# Altium project Environmental_unit.PrjPcb (part 1 of 2)
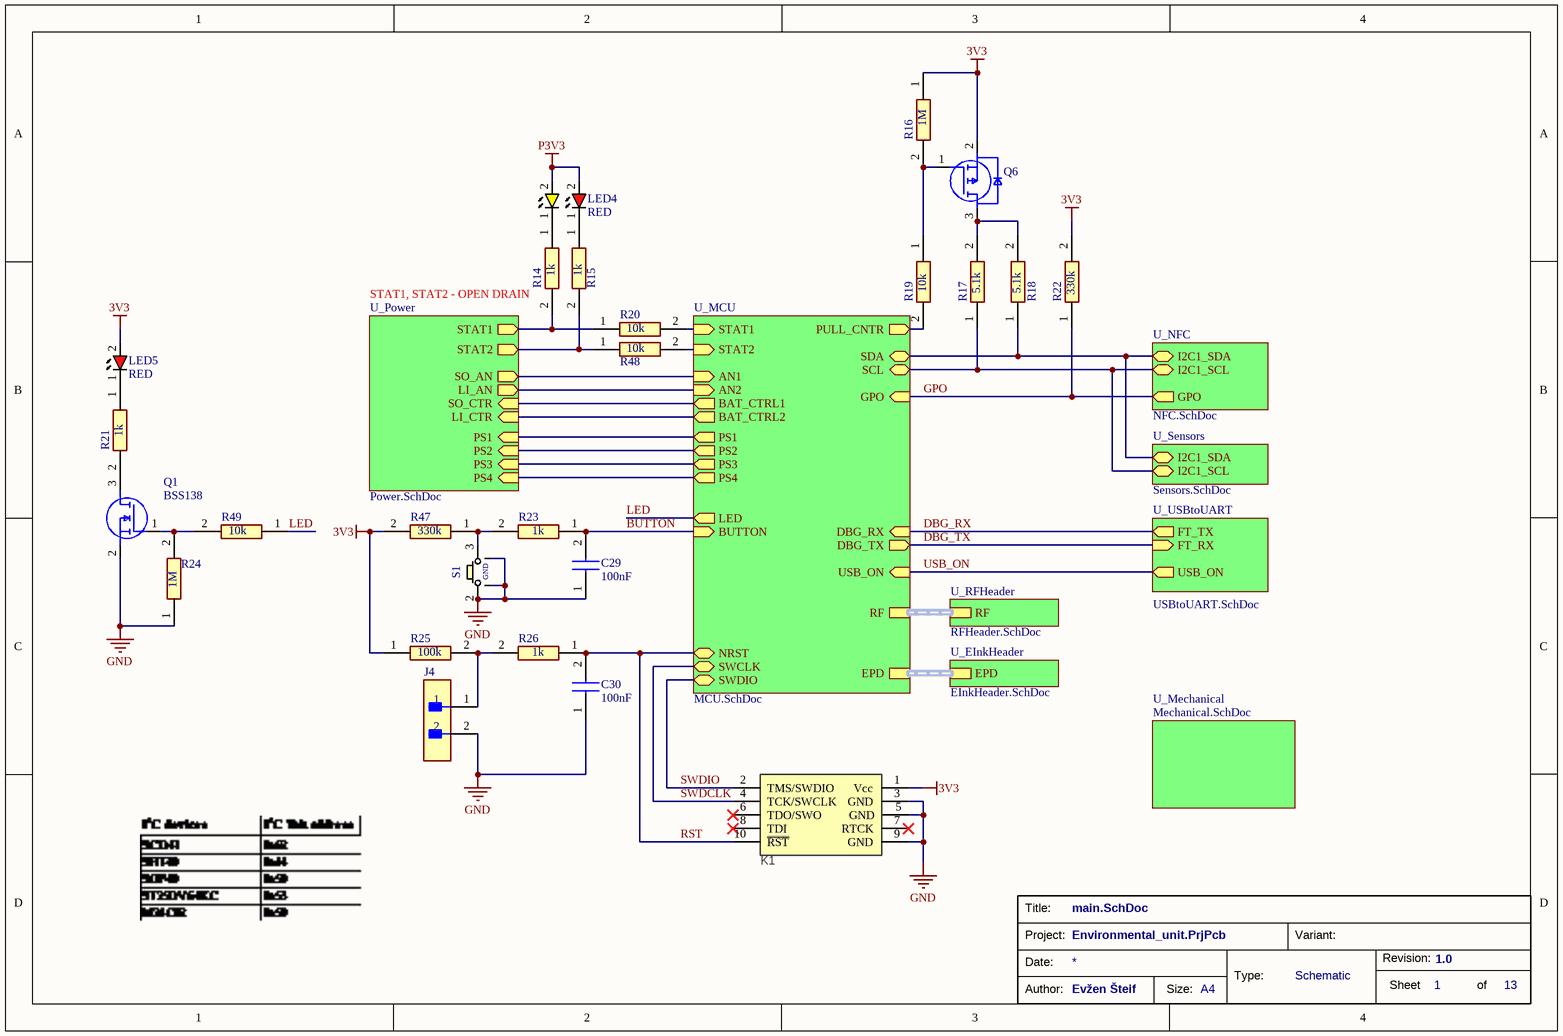
[diagram p0: main.SchDoc]
Author: Evžen Šteif; Revision: 1.0
9 sheets, 135 parts. Net scope: hierarchical (ports join the sheet entries above them; power ports are global).
Board file: EnvUnitPCB.PcbDoc
Sheets:
  main.SchDoc
    U_USBtoUART = USBtoUART.SchDoc
    U_NFC = NFC.SchDoc
    U_EInkHeader = EInkHeader.SchDoc
    U_MCU = MCU.SchDoc
    U_RFHeader = RFHeader.SchDoc
    U_Power = Power.SchDoc
      U_BatteryManagement = BatteryManagement.SchDoc
    U_Mechanical = Mechanical.SchDoc

## Sheet main.SchDoc
size A4; SheetNumber: 1; SheetTotal: 13

### Parts
C29  100nF  [CAPC1005X70N]
C30  100nF  [CAPC1005X70N]
J4  M20-9990246  [FP-M20-9990246-MFG]  (value not drawn)
K1  3220-10-0100-00  [TH_CON_MHDR2X5_PIT50_KEY]  (value not drawn)
LED3  150060YS75000  [LEDC1608X80N]  (value not drawn)
LED4  RED  [LEDC1608X80N]
LED5  RED  [LEDC1608X80N]
Q1  BSS138  [SOT95P240X120-3N]
Q6  SSM3J358R,LF  [SOTFL95P240X88-3N]  (value not drawn)
R14  1k  [RESC1005X35N]
R15  1k  [RESC1005X35N]
R16  1M  [RESC1005X40N]
R17  5.1k  [RESC1005X35N]
R18  5.1k  [RESC1005X35N]
R19  10k  [RESC1005X35N]
R20  10k  [RESC1005X35N]
R21  1k  [RESC1005X35N]
R22  330k  [RESC1005X40N]
R23  1k  [RESC1005X35N]
R24  1M  [RESC1005X40N]
R25  100k  [RESC1005X35N]
R26  1k  [RESC1005X35N]
R47  330k  [RESC1005X40N]
R48  10k  [RESC1005X35N]
R49  10k  [RESC1005X35N]
S1  431256038716  [431256038716]  (value not drawn)

### Sub-sheets
U_EInkHeader = EInkHeader.SchDoc: EPD (harness E1)
U_MCU = MCU.SchDoc: SWDIO (bidir), SWCLK (bidir), NRST (bidir), RF (harness RF_HARNESS), EPD (harness EPD_HARNESS), SCL (bidir), SDA (bidir), AN1 (in), AN2 (in), DBG_TX (out), DBG_RX (in), USB_ON (in), PS1 (out), PS2 (out), PS3 (out), PS4 (out), GPO (in), BUTTON (in), LED (out), STAT1 (in), STAT2 (in), BAT_CTRL1 (out), BAT_CTRL2 (out), PULL_CNTR (out)
U_Mechanical = Mechanical.SchDoc: no entries
U_NFC = NFC.SchDoc: GPO (out), I2C1_SCL (bidir), I2C1_SDA (bidir)
U_Power = Power.SchDoc: PS1 (in), PS2 (in), PS3 (in), LI_AN (out), SO_AN (out), LI_CTR (in), SO_CTR (in), PS4 (in), STAT1 (out), STAT2 (out)
U_RFHeader = RFHeader.SchDoc: RF (harness RF_HARNESS1)
U_Sensors = Sensors.SchDoc (file not in this document): I2C1_SDA (bidir), I2C1_SCL (bidir)
U_USBtoUART = USBtoUART.SchDoc: FT_TX (out), FT_RX (in), USB_ON (out)

### Nets
3V3: K1.1(Vcc) LED5.2(A) Q6.2(S) R16.1 R22.2 R25.1 R47.2
GND: C29.1 C30.1 J4.2 K1.3(GND) K1.5(GND) K1.9(GND) Q1.2(S) R24.1 S1.1 S1.2 S1.4
P3V3: LED3.2(A) LED4.2(A)
BUTTON: C29.2 R23.1 ; sheet U_MCU/BUTTON
DBG_RX: sheet U_USBtoUART/FT_TX, sheet U_MCU/DBG_RX
DBG_TX: sheet U_USBtoUART/FT_RX, sheet U_MCU/DBG_TX
GPO: R22.1 ; sheet U_NFC/GPO, sheet U_MCU/GPO
LED: R49.1 ; sheet U_MCU/LED
PS1: sheet U_MCU/PS1, sheet U_Power/PS1
PS2: sheet U_MCU/PS2, sheet U_Power/PS2
PS3: sheet U_MCU/PS3, sheet U_Power/PS3
PS4: sheet U_MCU/PS4, sheet U_Power/PS4
RST: C30.2 K1.10(~{RST}) R26.1 ; sheet U_MCU/NRST
SCL: R17.1 ; sheet U_Sensors/I2C1_SCL, sheet U_NFC/I2C1_SCL, sheet U_MCU/SCL
SDA: R18.1 ; sheet U_Sensors/I2C1_SDA, sheet U_NFC/I2C1_SDA, sheet U_MCU/SDA
STAT1: R14.2 R20.1 ; sheet U_Power/STAT1
STAT2: R15.2 R48.1 ; sheet U_Power/STAT2
SWDCLK: K1.4(TCK/SWCLK) ; sheet U_MCU/SWCLK
SWDIO: K1.2(TMS/SWDIO) ; sheet U_MCU/SWDIO
USB_ON: sheet U_USBtoUART/USB_ON, sheet U_MCU/USB_ON
NetIC3_8: sheet U_MCU/AN1, sheet U_Power/SO_AN
NetIC3_9: sheet U_MCU/AN2, sheet U_Power/LI_AN
NetIC3_10: sheet U_MCU/BAT_CTRL1, sheet U_Power/SO_CTR
NetIC3_11: sheet U_MCU/BAT_CTRL2, sheet U_Power/LI_CTR
NetIC3_17: R20.2 ; sheet U_MCU/STAT1
NetIC3_20: R48.2 ; sheet U_MCU/STAT2
NetIC3_61: R19.2 ; sheet U_MCU/PULL_CNTR
NetJ4_1: J4.1 R25.2 R26.2
NetLED3_1: LED3.1(K) R14.1
NetLED4_1: LED4.1(K) R15.1
NetLED5_1: LED5.1(K) R21.1
NetQ1_1: Q1.1(G) R24.2 R49.2
NetQ1_3: Q1.3(D) R21.2
NetQ6_1: Q6.1(G) R16.2 R19.1
NetQ6_3: Q6.3(D) R17.2 R18.2
NetR23_2: R23.2 R47.1 S1.3

Not connected (* = marked no-connect by the designer): K1 6(TDO/SWO)* 7(RTCK)* 8(TDI)*

### Buses and harness runs
harness sheet U_EInkHeader/EPD = sheet U_MCU/EPD
harness sheet U_MCU/RF = sheet U_RFHeader/RF

### Notes on the sheet
- (near R14) STAT1, STAT2 - OPEN DRAIN
- Title:
- Date:
- Project:
- Type:
- Schematic
- Variant:
- Revision:
- Sheet
- of
- Author:
- Evžen Šteif
- Size:
- A4
- (in symbol 431256038716) GND

### Library data of the parts
C29 C30 = GRM155R61A104KA01D: Capacitor; Manufacturer_Name: Murata Electronics; Datasheet Link: https://search.murata.co.jp/Ceramy/image/img/A01X/G101/ENG/GRM155R61A104KA01-02A.pdf; Height: 0.7mm; Manufacturer_Part_Number: GRM155R61A104KA01D; Mouser Part Number: 81-GRM155R61A104KA01; Mouser Price/Stock: https://www.mouser.co.uk/ProductDetail/Murata-Electronics/GRM155R61A104KA01D?qs=5bAuhL3RhmNZw0v59AqOJA%3D%3D; Arrow Part Number: GRM155R61A104KA01D; Arrow Price/Stock: https://www.arrow.com/en/products/grm155r61a104ka01d/murata-manufacturing?utm_currency=USD&region=europe
J4 = CMP-15831-000009-1: CONN HEADER VERT 2POS 2.54MM; Manufacturer: Harwin; Conn Gender: Male; Conn Orientation: Vertical; Number Of Contacts: 2; Current Rating: 3A; ComponentLink2URL: https://cdn.harwin.com/pdfs/M20-999.pdf; ComponentLink2Description: Datasheet; Package: M20-9990246; Temperature: -40°C to +105°C; Octopart: https://octopart.com/m20-9990246-harwin-2590635; Mouser Description: 2.54mm (0.1") Pitch SIL Vertical PC Tail Pin Header, 6.1mm mating pin height, tin, 2 contacts; Temperature Range High: +105°C; Device Class L1: Connectors; RoHS: TRUE; Automotive: No; Height: 8.99mm; Number Of Rows: 1; Contact Material: Tin,Nickel; Category: Conn; Pitch: 2.54mm; Lead Free: Yes; Digikey Description: CONN HEADER VERT 2POS 2.54MM; Manufacturer Part Number: M20-9990246; Temperature Range Low: -40°C; Device Class L3: unset; Device Class L2: Headers and Wire Housings
K1 = TEST_00015: Cortex ARM JTAG 10 Pin, Header; Manufacturer: CNC Tech; Autor: Krutina; Id: 15; Designer: Krahulec; Active: 1; Validated in design: 0; Count: 585; Generic_replacement: No; LE_Price: 0.363527; Location: LE; Sourcing: Manufacturer; Value: ARM JTAG 10; LastRevisionDate: 28.7.2015; PartNumber: TEST_00015; Technology: THT; Librarian: Krahulec; Supplier 1: Digi-Key; Supplier Part Number 1: 1175-1627-ND; ComponentLink1URL: http://www.cnctech.us/; ComponentLink1Description: Manufacturer Web; Cat1: JTAG; Cat2: ARM; ROHS: 1; Jablotron_Price: 0; Manufacturer Part Number: 3220-10-0100-00
LED3 = 150060YS75000: LED; Manufacturer_Name: Wurth Elektronik; Datasheet Link: http://uk.rs-online.com/web/p/products/8154219; Height: 0.8mm; Manufacturer_Part_Number: 150060YS75000; Mouser Part Number: 710-150060YS75000; Mouser Price/Stock: https://www.mouser.co.uk/ProductDetail/Wurth-Elektronik/150060YS75000?qs=LlUlMxKIyB0nKmwefHgtZw%3D%3D
LED4 LED5 = 150060RS55040: LED; Manufacturer_Name: Wurth Elektronik; Manufacturer_Part_Number: 150060RS75000; Datasheet Link: https://componentsearchengine.com/Datasheets/2/150060GS75000.pdf; Height: 0.8mm; Mouser Part Number: 710-150060RS75000; Mouser Price/Stock: https://www.mouser.co.uk/ProductDetail/Wurth-Elektronik/150060GS75000?qs=LlUlMxKIyB0UYkq5lDO8nA%3D%3D
Q1 = BSS138: MOSFET (N-Channel); Manufacturer_Name: onsemi; Datasheet Link: https://www.onsemi.com/pub/Collateral/BSS138-D.PDF; Height: 1.2mm; Manufacturer_Part_Number: BSS138; Mouser Part Number: 512-BSS138; Mouser Price/Stock: https://www.mouser.co.uk/ProductDetail/onsemi-Fairchild/BSS138?qs=HK%252BeIG1iaahCeqBvjB4arg%3D%3D; Arrow Part Number: BSS138; Arrow Price/Stock: https://www.arrow.com/en/products/bss138/on-semiconductor?utm_currency=USD&region=europe
Q6 = SSM3J358R,LF: MOSFET (P-Channel); Manufacturer_Name: Toshiba; Datasheet Link: https://toshiba.semicon-storage.com/ap-en/product/mosfet/detail.SSM3J358R.html; Height: 0.88mm; Manufacturer_Part_Number: SSM3J358R,LF; Mouser Part Number: 757-SSM3J358RLF; Mouser Price/Stock: https://www.mouser.co.uk/ProductDetail/Toshiba/SSM3J358RLF?qs=HXFqYaX1Q2xwvCtt1GGmkw%3D%3D; Arrow Part Number: SSM3J358R,LF; Arrow Price/Stock: https://www.arrow.com/en/products/ssm3j358rlf/toshiba?region=nac
R14 R15 R21 R23 R26 = RT0402FRE071KL: Resistor; Manufacturer_Name: KEMET; Datasheet Link: https://www.yageo.com/upload/media/product/productsearch/datasheet/rchip/PYu-RT_1-to-0.01_RoHS_L_11.pdf; Height: 0.35mm; Manufacturer_Part_Number: RT0402FRE071KL; Mouser Part Number: RT0402FRE071KL; Mouser Price/Stock: https://www.mouser.co.uk/ProductDetail/YAGEO/RT0402FRE07100KL?qs=BXCcY9r%252B08CxTvf5JB1kiw%3D%3D; Arrow Part Number: RT0402FRE07100KL; Arrow Price/Stock: https://www.arrow.com/en/products/rt0402fre07100kl/yageo
R16 R24 = RC0402FR-071ML: Resistor; Manufacturer_Name: YAGEO; Datasheet Link: https://componentsearchengine.com/Datasheets/2/RC0402FR-071ML.pdf; Height: 0.4mm; Manufacturer_Part_Number: RC0402FR-071ML; Mouser Part Number: 603-RC0402FR-071ML; Mouser Price/Stock: https://www.mouser.co.uk/ProductDetail/YAGEO/RC0402FR-071ML?qs=V1yeUXFNrknfoI4987wfBQ%3D%3D; Arrow Part Number: RC0402FR-071ML; Arrow Price/Stock: https://www.arrow.com/en/products/rc0402fr-071ml/yageo?region=nac
R17 R18 = RT0402FRE075K1L: Resistor; Manufacturer_Name: YAGEO; Datasheet Link: https://www.yageo.com/upload/media/product/app/datasheet/rchip/pyu-rt_1-to-0.01_rohs_l.pdf; Height: 0.35mm; Manufacturer_Part_Number: RT0402FRE075K1L; Mouser Part Number: RT0402FRE075K1L; Mouser Price/Stock: https://www.mouser.co.uk/ProductDetail/YAGEO/RT0402FRE07100RL?qs=BXCcY9r%252B08AcvLZjF7vcwQ%3D%3D
R19 R20 R48 R49 = RT0402FRE0710KL: Resistor; Manufacturer_Name: KEMET; Datasheet Link: https://cz.mouser.com/datasheet/2/447/PYu_RT_1_to_0_01_RoHS_L_15-3461507.pdf; Height: 0.35mm; Manufacturer_Part_Number: RT0402FRE0710KL; Mouser Part Number: 603-RT0402FRE0710KL; Mouser Price/Stock: https://www.mouser.co.uk/ProductDetail/YAGEO/RT0402FRE07100KL?qs=BXCcY9r%252B08CxTvf5JB1kiw%3D%3D; Arrow Part Number: RT0402FRE07100KL; Arrow Price/Stock: https://www.arrow.com/en/products/rt0402fre07100kl/yageo
R22 R47 = RC0402BR-07330KL: Resistor; Manufacturer_Name: YAGEO; Datasheet Link: https://cz.mouser.com/datasheet/2/447/PYu_RC_Group_51_RoHS_L_11-1984063.pdf; Height: 0.4mm; Manufacturer_Part_Number: RC0402BR-07330KL
R25 = RT0402FRE07100KL: Resistor; Manufacturer_Name: KEMET; Datasheet Link: https://www.yageo.com/upload/media/product/productsearch/datasheet/rchip/PYu-RT_1-to-0.01_RoHS_L_11.pdf; Height: 0.35mm; Manufacturer_Part_Number: RT0402FRE07100KL; Mouser Part Number: 603-RT0402FRE07100KL; Mouser Price/Stock: https://www.mouser.co.uk/ProductDetail/YAGEO/RT0402FRE07100KL?qs=BXCcY9r%252B08CxTvf5JB1kiw%3D%3D; Arrow Part Number: RT0402FRE07100KL; Arrow Price/Stock: https://www.arrow.com/en/products/rt0402fre07100kl/yageo
S1 = 431256038716: Switch; Manufacturer_Name: Wurth Elektronik; Datasheet Link: https://www.we-online.com/components/products/datasheet/431256038716.pdf; Height: 7.2mm; Manufacturer_Part_Number: 431256038716; Mouser Part Number: 710-431256038716; Mouser Price/Stock: https://www.mouser.co.uk/ProductDetail/Wurth-Elektronik/431256038716?qs=2kOmHSv6VfR5N0FN9BhJ6g%3D%3D

## Sheet USBtoUART.SchDoc
size A4; SheetNumber: 9; SheetTotal: 13
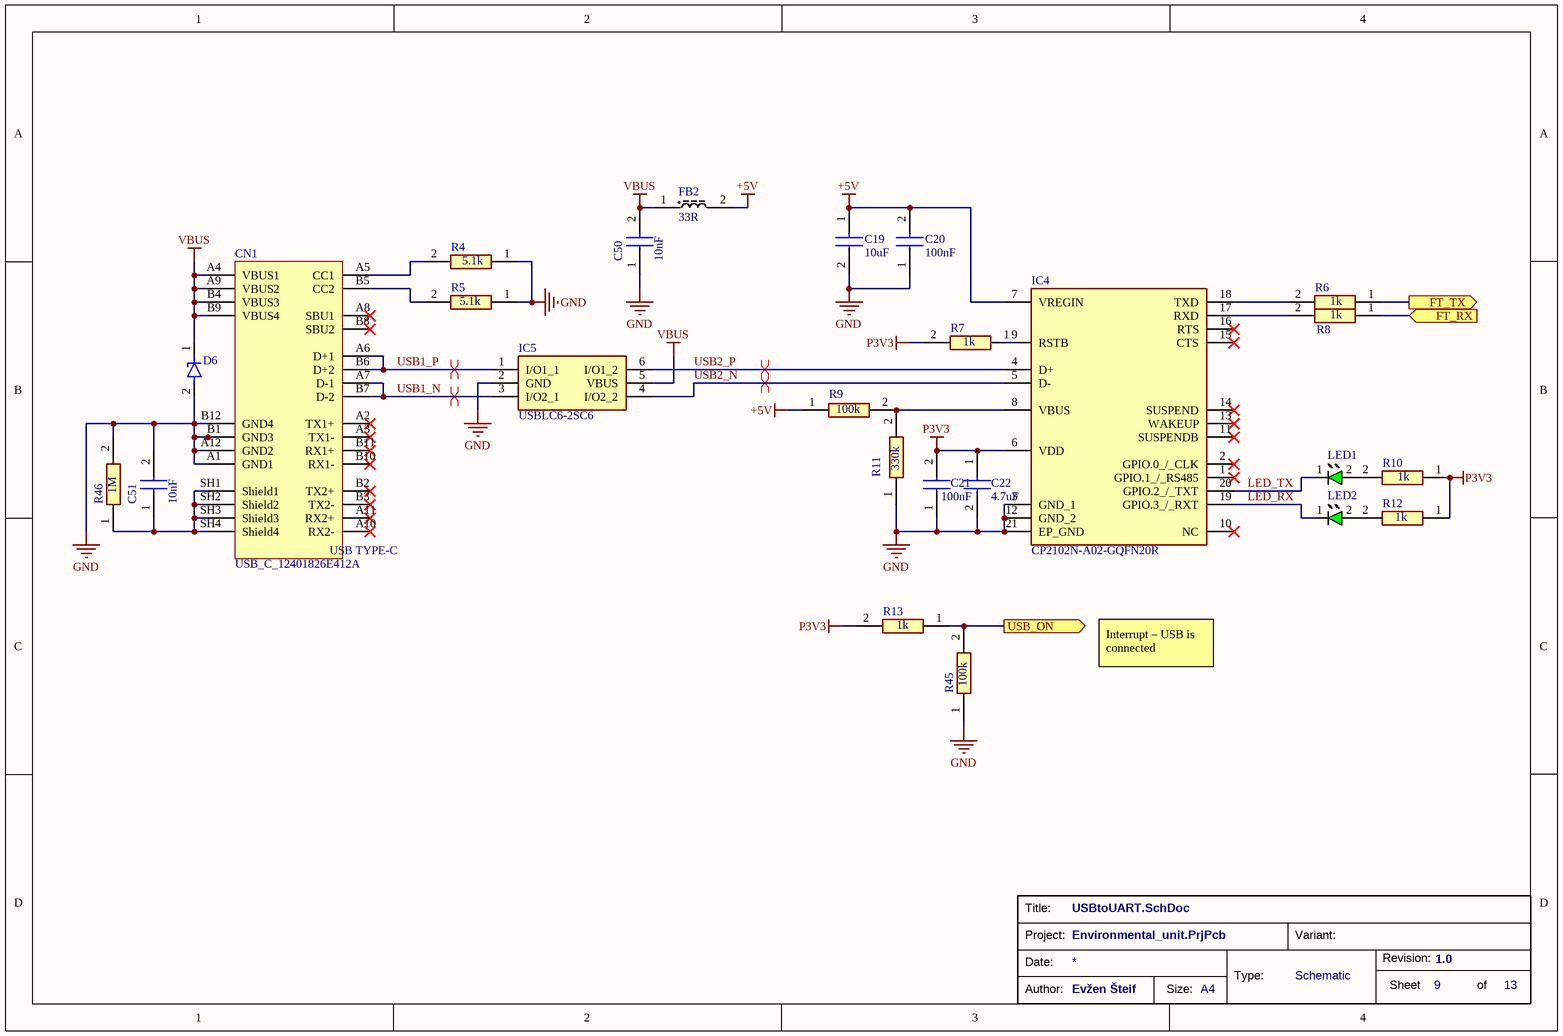
[diagram p1: USBtoUART.SchDoc]

### Parts
C19  10uF  [GRM18x]
C20  100nF  [CAPC1005X70N]
C21  100nF  [CAPC1005X70N]
C22  4.7uF  [CAPC1608X90N]
C50  10nF  [GRM15x]
C51  10nF  [GRM15x]
CN1  value USB_C_12401826E412A  [CON_USB-TYPEC_AMPHENOL_12401826E412A]  (hidden comment: USB_TYPE_C_Receptacle)
D6  ESDA25P35-1U1M  [ESDA25P351U1M]  (value not drawn)
FB2  33R  [BLM18SP221SN1B]
IC4  CP2102N-A02-GQFN20R  [CP2102NA02GQFN20]
IC5  USBLC6-2SC6  [SOT95P280X145-6N]
LED1  150060GS75000  [LEDC1608X80N]  (value not drawn)
LED2  150060GS75000  [LEDC1608X80N]  (value not drawn)
R4  5.1k  [RESC1005X35N]
R5  5.1k  [RESC1005X35N]
R6  1k  [RESC1005X35N]
R7  1k  [RESC1005X35N]
R8  1k  [RESC1005X35N]
R9  100k  [RESC1005X40N]
R10  1k  [RESC1005X35N]
R11  330k  [RESC1005X40N]
R12  1k  [RESC1005X35N]
R13  1k  [RESC1005X35N]
R45  100k  [RESC1005X40N]
R46  1M  [RESC1005X40N]

### Ports
FT_RX (in, see main[3C]), FT_TX (out, see main[3C]), USB_ON (out, see main[3C], MCU[1B])

### Nets
+5V: C19.1 C20.2 FB2.2 IC4.7(VREGIN) R9.1
GND: C19.2 C20.1 C21.1 C22.2 C50.1 C51.2 CN1.A1(GND1) CN1.A12(GND2) CN1.B1(GND3) CN1.B12(GND4) D6.2(A) IC4.3(GND_1) IC4.12(GND_2) IC4.21(EP_GND) IC5.2(GND) R4.1 R5.1 R11.1 R45.1 R46.2
P3V3: C21.2 C22.1 IC4.6(VDD) R7.2 R10.1 R12.1 R13.2
VBUS: C50.2 CN1.A4(VBUS1) CN1.A9(VBUS2) CN1.B4(VBUS3) CN1.B9(VBUS4) D6.1(K) FB2.1 IC5.5(VBUS)
DBG_RX: R6.1 ; port FT_TX
DBG_TX: R8.1 ; port FT_RX
LED_RX: IC4.19(GPIO.3_/_RXT) LED2.1(K)
LED_TX: IC4.20(GPIO.2_/_TXT) LED1.1(K)
USB1_N: CN1.A7(D-1) CN1.B7(D-2) IC5.3(I/O2_1)
USB1_P: CN1.A6(D+1) CN1.B6(D+2) IC5.1(I/O1_1)
USB2_N: IC4.5(D-) IC5.4(I/O2_2)
USB2_P: IC4.4(D+) IC5.6(I/O1_2)
USB_ON: R13.1 R45.2 ; port USB_ON
NetC51_1: C51.1 CN1.SH1(Shield1) CN1.SH2(Shield2) CN1.SH3(Shield3) CN1.SH4(Shield4) R46.1
NetCN1_A5: CN1.A5(CC1) R4.2
NetCN1_B5: CN1.B5(CC2) R5.2
NetIC4_8: IC4.8(VBUS) R9.2 R11.2
NetIC4_9: IC4.9(RSTB) R7.1
NetIC4_17: IC4.17(RXD) R8.2
NetIC4_18: IC4.18(TXD) R6.2
NetLED1_2: LED1.2(A) R10.2
NetLED2_2: LED2.2(A) R12.2

Not connected (* = marked no-connect by the designer): CN1 A2(TX1+)* A3(TX1-)* A8(SBU1)* A10(RX2-)* A11(RX2+)* B2(TX2+)* B3(TX2-)* B8(SBU2)* B10(RX1-)* B11(RX1+)*; IC4 1(GPIO.1_/_RS485)* 2(GPIO.0_/_CLK)* 10(NC)* 11(SUSPENDB)* 13(WAKEUP)* 14(SUSPEND)* 15(CTS)* 16(RTS)*

### Layout directives
differential pair; differential pair class USB; net class USB: USB1_N, USB1_P, USB2_N, USB2_P

### Notes on the sheet
- Interrupt – USB is connected
- Title:
- Date:
- Project:
- Type:
- Schematic
- Variant:
- Revision:
- Sheet
- of
- Author:
- Evžen Šteif
- Size:
- A4
- (in symbol MCD-03232) USB TYPE-C

### Library data of the parts
C19 = GRM188R61E106KA73D: Capacitor; Manufacturer_Name: Murata Electronics; Datasheet Link: https://search.murata.co.jp/Ceramy/image/img/A01X/G101/ENG/GRM188R61E106KA73-01A.pdf; Height: 0.9mm; Manufacturer_Part_Number: GRM188R61E106KA73D; Mouser Part Number: 81-GRM188R61E106KA3D; Mouser Price/Stock: https://www.mouser.co.uk/ProductDetail/Murata-Electronics/GRM188R61E106KA73D?qs=5aG0NVq1C4z8ebxPkQZf9A%3D%3D; Arrow Part Number: GRM188R61E106KA73D; Arrow Price/Stock: https://www.arrow.com/en/products/grm188r61e106ka73d/murata-manufacturing?region=nac
C20 C21 = GRM155R61A104KA01D: as C29 on sheet main; Datasheet Link: https://search.murata.co.jp/Ceramy/image/img/A01X/G101/ENG/GRM155R61A104KA01-02A.pdf; Height: 0.7mm; Manufacturer_Part_Number: GRM155R61A104KA01D; Mouser Part Number: 81-GRM155R61A104KA01; Mouser Price/Stock: https://www.mouser.co.uk/ProductDetail/Murata-Electronics/GRM155R61A104KA01D?qs=5bAuhL3RhmNZw0v59AqOJA%3D%3D; Arrow Part Number: GRM155R61A104KA01D; Arrow Price/Stock: https://www.arrow.com/en/products/grm155r61a104ka01d/murata-manufacturing?utm_currency=USD&region=europe
C22 = GRM188R61E475KE11J: Capacitor; Manufacturer_Name: Murata Electronics; Datasheet Link: https://search.murata.co.jp/Ceramy/image/img/A01X/G101/ENG/GRM188R61E475KE11-01A.pdf; Height: 0.9mm; Manufacturer_Part_Number: GRM188R61E475KE11J; Mouser Part Number: 81-GRM188R61E475KE1J; Mouser Price/Stock: https://www.mouser.co.uk/ProductDetail/Murata-Electronics/GRM188R61E475KE11J?qs=hNud%2FORuBR3%2Fa9GLJFT8KA%3D%3D; Arrow Part Number: GRM188R61E475KE11J; Arrow Price/Stock: https://www.arrow.com/en/products/grm188r61e475ke11j/murata-manufacturing
C50 C51 = GRM155R71H103KA88D: Capacitor; Manufacturer_Name: Murata Electronics; Datasheet Link: https://search.murata.co.jp/Ceramy/image/img/A01X/G101/ENG/GRM155R71H103KA88-01A.pdf; Height: 0.33mm; Manufacturer_Part_Number: GRM155R71H103KA88D; Mouser Part Number: 81-GRM155R71H103KA8D; Mouser Price/Stock: https://www.mouser.co.uk/ProductDetail/Murata-Electronics/GRM155R71H103KA88D?qs=Dfh4SrgScWxOVlCuzd3ZyQ%3D%3D; Arrow Part Number: GRM155R71H103KA88D; Arrow Price/Stock: https://www.arrow.com/en/products/grm155r71h103ka88d/murata-manufacturing?utm_currency=USD&region=nac
CN1 = MCD-03232: USB_TypeC, 24 pins, RA, SMD, T=2.96mm (USB Certified 3.1); Part_Type: Connector; Part_Preference: Recommended; Manufacturer: AMPHENOL ICC; Manufacturer_Part_Number: 12401826E412A; Component_Country_Of_Origin: China°; ShowFields: YES; ID: 5348; Internal_Part_Number: MCD-03232; Status: Checked; ComponentLink1URL: http://tunmcdsvn.tun.st.com/Component_Documentation_Library/Trunk/Connector/AMPHEMOL_ICC_12401826E412A; Order_Code_Digikey: 12401826E412ATR-ND; Order_Code_Farnell: 3727763; Order_Code_RS: N/A
D6 = ESDA25P35-1U1M: TVS Diode (Uni-directional); Manufacturer_Name: STMicroelectronics; Datasheet Link: https://www.st.com/resource/en/datasheet/esda25p35-1u1m.pdf; Height: 0.6mm; Manufacturer_Part_Number: ESDA25P35-1U1M; Mouser Part Number: 511-ESDA25P35-1U1M; Mouser Price/Stock: https://www.mouser.co.uk/ProductDetail/STMicroelectronics/ESDA25P35-1U1M?qs=aVyJF2WnouQUWqgNP85ZrA%3D%3D; Arrow Part Number: ESDA25P35-1U1M; Arrow Price/Stock: https://www.arrow.com/en/products/esda25p35-1u1m/stmicroelectronics?utm_currency=USD&region=europe
FB2 = BLM18SG330SN1D: Ferrite Bead; Manufacturer_Name: Murata Electronics; Datasheet Link: http://www.murata.com/~/media/webrenewal/support/library/catalog/products/emc/emifil/c31e.ashx?la=en-gb; Height: 0.95mm; Manufacturer_Part_Number: BLM18SG330SN1D; Mouser Part Number: 81-BLM18SG330SN1D; Mouser Price/Stock: https://www.mouser.co.uk/ProductDetail/Murata-Electronics/BLM18SG330SN1D?qs=7EBvPakHacUT88safgvlfQ%3D%3D; Arrow Part Number: BLM18SG330SN1D; Arrow Price/Stock: https://www.arrow.com/en/products/blm18sg330sn1d/murata-manufacturing
IC4 = CP2102N-A02-GQFN20R: Integrated Circuit; Manufacturer_Name: Silicon Labs; Datasheet Link: https://www.silabs.com/documents/public/data-sheets/cp2102n-datasheet.pdf; Height: 0.8mm; Manufacturer_Part_Number: CP2102N-A02-GQFN20R; Mouser Part Number: 634-CP2102NA02QFN20R; Mouser Price/Stock: https://www.mouser.co.uk/ProductDetail/Silicon-Labs/CP2102N-A02-GQFN20R?qs=u16ybLDytRbf2uwPkMBdUg%3D%3D; Arrow Part Number: CP2102N-A02-GQFN20R; Arrow Price/Stock: https://www.arrow.com/en/products/cp2102n-a02-gqfn20r/silicon-labs?utm_currency=USD&region=nac
IC5 = USBLC6-2SC6: Integrated Circuit; Manufacturer_Name: STMicroelectronics; Datasheet Link: http://www.st.com/st-web-ui/static/active/en/resource/technical/document/datasheet/CD00050750.pdf; Height: 1.45mm; Manufacturer_Part_Number: USBLC6-2SC6; Mouser Part Number: 511-USBLC6-2SC6; Mouser Price/Stock: https://www.mouser.co.uk/ProductDetail/STMicroelectronics/USBLC6-2SC6?qs=po45yt2pPpu%2FhNIlwQdTlg%3D%3D; Arrow Part Number: USBLC6-2SC6; Arrow Price/Stock: https://www.arrow.com/en/products/usblc6-2sc6/stmicroelectronics?utm_currency=USD&region=europe
LED1 LED2 = 150060GS75000: LED; Manufacturer_Name: Wurth Elektronik; Datasheet Link: https://componentsearchengine.com/Datasheets/2/150060GS75000.pdf; Height: 0.8mm; Manufacturer_Part_Number: 150060GS75000; Mouser Part Number: 710-150060GS75000; Mouser Price/Stock: https://www.mouser.co.uk/ProductDetail/Wurth-Elektronik/150060GS75000?qs=LlUlMxKIyB0UYkq5lDO8nA%3D%3D
R4 R5 = RT0402FRE075K1L: Resistor; Manufacturer_Name: YAGEO; Datasheet Link: https://www.yageo.com/upload/media/product/app/datasheet/rchip/pyu-rt_1-to-0.01_rohs_l.pdf; Height: 0.35mm; Manufacturer_Part_Number: RT0402FRE075K1L; Mouser Part Number: RT0402FRE075K1L; Mouser Price/Stock: https://www.mouser.co.uk/ProductDetail/YAGEO/RT0402FRE07100RL?qs=BXCcY9r%252B08AcvLZjF7vcwQ%3D%3D
R6-R8 R10 R12 R13 = RT0402FRE071KL: Resistor; Manufacturer_Name: KEMET; Datasheet Link: https://www.yageo.com/upload/media/product/productsearch/datasheet/rchip/PYu-RT_1-to-0.01_RoHS_L_11.pdf; Height: 0.35mm; Manufacturer_Part_Number: RT0402FRE071KL; Mouser Part Number: RT0402FRE071KL; Mouser Price/Stock: https://www.mouser.co.uk/ProductDetail/YAGEO/RT0402FRE07100KL?qs=BXCcY9r%252B08CxTvf5JB1kiw%3D%3D; Arrow Part Number: RT0402FRE07100KL; Arrow Price/Stock: https://www.arrow.com/en/products/rt0402fre07100kl/yageo
R9 R45 = RC0402BR-07100KL: Resistor; Manufacturer_Name: YAGEO; Datasheet Link: https://cz.mouser.com/datasheet/2/447/PYu_RC_Group_51_RoHS_L_12-3368608.pdf; Height: 0.4mm; Manufacturer_Part_Number: RC0402BR-07100KL
R11 = RC0402BR-07330KL: Resistor; Manufacturer_Name: YAGEO; Datasheet Link: https://cz.mouser.com/datasheet/2/447/PYu_RC_Group_51_RoHS_L_11-1984063.pdf; Height: 0.4mm; Manufacturer_Part_Number: RC0402BR-07330KL
R46 = RC0402FR-071ML: Resistor; Manufacturer_Name: YAGEO; Datasheet Link: https://componentsearchengine.com/Datasheets/2/RC0402FR-071ML.pdf; Height: 0.4mm; Manufacturer_Part_Number: RC0402FR-071ML; Mouser Part Number: 603-RC0402FR-071ML; Mouser Price/Stock: https://www.mouser.co.uk/ProductDetail/YAGEO/RC0402FR-071ML?qs=V1yeUXFNrknfoI4987wfBQ%3D%3D; Arrow Part Number: RC0402FR-071ML; Arrow Price/Stock: https://www.arrow.com/en/products/rc0402fr-071ml/yageo?region=nac

## Sheet NFC.SchDoc
size A4; SheetNumber: 11; SheetTotal: 13
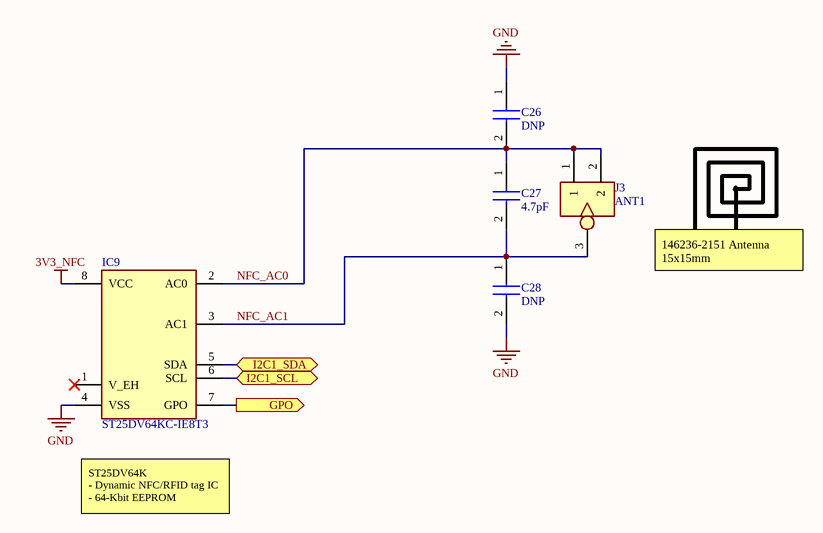
[diagram p2: NFC.SchDoc]

### Parts
C26  DNP  [CAPC1005X70N]
C27  4.7pF  [CAPC1005X70N]
C28  DNP  [CAPC1005X70N]
IC9  ST25DV64KC-IE8T3  [SOP65P640X120-8N]
J3  ANT1  [RECE.20279.001E.01]

### Ports
GPO (out, see main[3B], MCU[1C]), I2C1_SCL (bidir, see main[3B], Sensors[1B]), I2C1_SDA (bidir, see main[3B], Sensors[1B])

### Nets
3V3_NFC: IC9.8(VCC)
GND: C26.1 C28.2 IC9.4(VSS)
GPO: IC9.7(GPO) ; port GPO
NFC_AC0: C26.2 C27.1 IC9.2(AC0) J3.1 J3.2
NFC_AC1: C27.2 C28.1 IC9.3(AC1) J3.3
SCL: IC9.6(SCL) ; port I2C1_SCL
SDA: IC9.5(SDA) ; port I2C1_SDA

Not connected (* = marked no-connect by the designer): IC9 1(V_EH)*

### Notes on the sheet
- 146236-2151 Antenna 15x15mm
- ST25DV64K
  - Dynamic NFC/RFID tag IC
  - 64-Kbit EEPROM
- Title:
- Date:
- Project:
- Type:
- Schematic
- Variant:
- Revision:
- Sheet
- of
- Author:
- Evžen Šteif
- Size:
- A4

### Library data of the parts
C26-C28 = GRM1555C2A4R7WA01D: Capacitor; Manufacturer_Name: Murata Electronics; Datasheet Link: https://search.murata.co.jp/Ceramy/image/img/A01X/G101/ENG/GRM1555C2A4R7WA01-01A.pdf; Height: 0.7mm; Manufacturer_Part_Number: GRM1555C2A4R7WA01D; Mouser Part Number: 81-GRM1555C2A4R7WA1D; Mouser Price/Stock: https://www.mouser.com/Search/Refine.aspx?Keyword=81-GRM1555C2A4R7WA1D
IC9 = ST25DV64KC-IE8T3: Integrated Circuit; Manufacturer_Name: STMicroelectronics; Datasheet Link: https://www.st.com/resource/en/datasheet/st25dv64kc.pdf; Height: 1.2mm; Manufacturer_Part_Number: ST25DV64KC-IE8T3; Mouser Part Number: 511-ST25DV64KC-IE8T3; Mouser Price/Stock: https://www.mouser.co.uk/ProductDetail/STMicroelectronics/ST25DV64KC-IE8T3?qs=QNEnbhJQKva4ZdUvGL0fuA%3D%3D; Arrow Part Number: ST25DV64KC-IE8T3; Arrow Price/Stock: https://www.arrow.com/en/products/st25dv64kc-ie8t3/stmicroelectronics?utm_currency=USD&region=nac
J3 = RECE-20279-001E-01: Connector; Manufacturer_Name: Taoglas; Manufacturer_Part_Number: RECE-20279-001E-01; Mouser Part Number: N/A; Mouser Price/Stock: https://www.mouser.co.uk/ProductDetail/Taoglas/RECE-20279-001E-01?qs=WUa1z%2FNV9%252B3mVij1vDlP0A%3D%3D

## Sheet EInkHeader.SchDoc
size A4; SheetNumber: 12; SheetTotal: 13
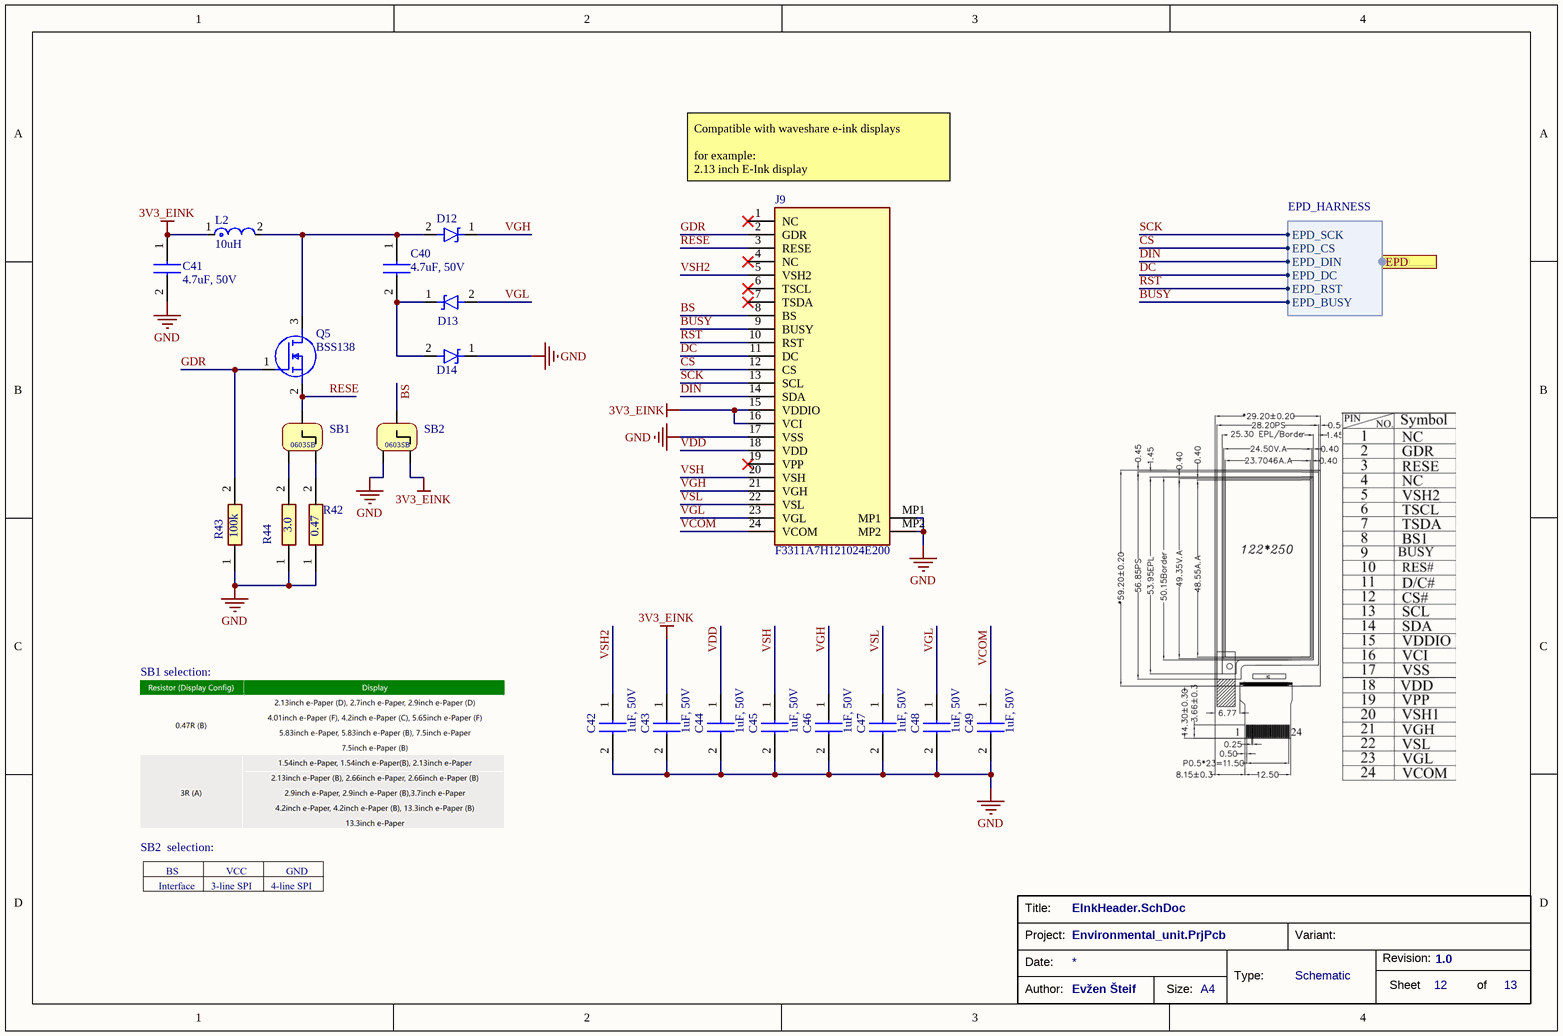
[diagram p3: EInkHeader.SchDoc]

### Parts
C40  4.7uF, 50V  [CAPC2012X145N]
C41  4.7uF, 50V  [CAPC2012X145N]
C42  1uF, 50V  [CAPC1608X90N]
C43  1uF, 50V  [CAPC1608X90N]
C44  1uF, 50V  [CAPC1608X90N]
C45  1uF, 50V  [CAPC1608X90N]
C46  1uF, 50V  [CAPC1608X90N]
C47  1uF, 50V  [CAPC1608X90N]
C48  1uF, 50V  [CAPC1608X90N]
C49  1uF, 50V  [CAPC1608X90N]
D12  MBR0530T1G  [SOD3716X135N]  (value not drawn)
D13  MBR0530T1G  [SOD3716X135N]  (value not drawn)
D14  MBR0530T1G  [SOD3716X135N]  (value not drawn)
J9  F3311A7H121024E200  [F3311A7H121024E200]
L2  10uH  [FP-EPL2010_H1_05-MFG]
Q5  BSS138  [SOT95P240X120-3N]
R42  0.47  [ERJ3_B_BQ_BW_LW_(0603)]
R43  100k  [RESC1005X35N]
R44  3.0  [ERJ3_B_BQ_BW_LW_(0603)]
SB1  SP0603_RIGHT  [SP0603-RIGHT]  (value not drawn)
SB2  SP0603_RIGHT  [SP0603-RIGHT]  (value not drawn)

### Ports
EPD (harness EPD_HARNESS, see main[3C], MCU[3C])

### Harnesses
EPD_HARNESS: EPD_DIN, EPD_SCK, EPD_CS, EPD_DC, EPD_RST, EPD_BUSY

### Nets
3V3_EINK: C41.1 C43.1 J9.15(VDDIO) J9.16(VCI) L2.1 SB2.2
GND: C41.2 C42.2 C43.2 C44.2 C45.2 C46.2 C47.2 C48.2 C49.2 D14.1(K) J9.17(VSS) J9.MP1 J9.MP2 R42.1 R43.1 R44.1 SB2.3
BS: J9.8(BS) SB2.1
BUSY: J9.9(BUSY) ; port EPD.EPD_BUSY
CS: J9.12(CS) ; port EPD.EPD_CS
DC: J9.11(DC) ; port EPD.EPD_DC
DIN: J9.14(SDA) ; port EPD.EPD_DIN
GDR: J9.2(GDR) Q5.1(G) R43.2
RESE: J9.3(RESE) Q5.2(S) SB1.1
RST: J9.10(RST) ; port EPD.EPD_RST  [project net EPD_RST]
SCK: J9.13(SCL) ; port EPD.EPD_SCK  [project net EPD_SCK]
VCOM: C49.1 J9.24(VCOM)
VDD: C44.1 J9.18(VDD)
VGH: C46.1 D12.1(K) J9.21(VGH)
VGL: C48.1 D13.2(A) J9.23(VGL)
VSH: C45.1 J9.20(VSH)
VSH2: C42.1 J9.5(VSH2)
VSL: C47.1 J9.22(VSL)
NetC40_1: C40.1 D12.2(A) L2.2 Q5.3(D)
NetC40_2: C40.2 D13.1(K) D14.2(A)
NetR42_2: R42.2 SB1.2
NetR44_2: R44.2 SB1.3

Not connected (* = marked no-connect by the designer): J9 1(NC)* 4(NC)* 6(TSCL)* 7(TSDA)* 19(VPP)*

### Notes on the sheet
- (near J9) Compatible with waveshare e-ink displays
  for example:
  2.13 inch E-Ink display
- SB1 selection:
- SB2  selection:
- Title:
- Date:
- Project:
- Type:
- Schematic
- Variant:
- Revision:
- Sheet
- of
- Author:
- Evžen Šteif
- Size:
- A4
- (in symbol SP0603_RIGHT) 0603SB

### Library data of the parts
C40 C41 = GRM21BR61H475KE51L: Capacitor; Manufacturer_Name: Murata Electronics; Datasheet Link: https://search.murata.co.jp/Ceramy/image/img/A01X/G101/ENG/GRM21BR61H475KE51-01A.pdf; Height: 1.45mm; Manufacturer_Part_Number: GRM21BR61H475KE51L; Mouser Part Number: 81-GRM21BR61H475KE1L; Mouser Price/Stock: https://www.mouser.co.uk/ProductDetail/Murata-Electronics/GRM21BR61H475KE51L?qs=eeBpzGFlv%252B%252BOtLzDC1PY6Q%3D%3D; Arrow Part Number: GRM21BR61H475KE51L; Arrow Price/Stock: https://www.arrow.com/en/products/grm21br61h475ke51l/murata-manufacturing?region=nac
C42-C49 = GRT188R61H105KE13D: Capacitor; Manufacturer_Name: Murata Electronics; Datasheet Link: https://search.murata.co.jp/Ceramy/image/img/A01X/G101/ENG/GRT188R61H105KE13-01A.pdf; Height: 0.9mm; Manufacturer_Part_Number: GRT188R61H105KE13D; Mouser Part Number: 81-GRT188R61H105KE3D; Mouser Price/Stock: https://www.mouser.co.uk/ProductDetail/Murata-Electronics/GRT188R61H105KE13D?qs=drgMNd%252BkGPNIxxtJByMGCg%3D%3D; Arrow Part Number: GRT188R61H105KE13D; Arrow Price/Stock: https://www.arrow.com/en/products/grt188r61h105ke13d/murata-manufacturing?region=nac
D12-D14 = MBR0530T1G: Diode; Manufacturer_Name: onsemi; Datasheet Link: https://www.onsemi.com/pub/Collateral/MBR0530T1-D.PDF; Height: 1.35mm; Manufacturer_Part_Number: MBR0530T1G; Mouser Part Number: 863-MBR0530T1G; Mouser Price/Stock: https://www.mouser.co.uk/ProductDetail/onsemi/MBR0530T1G?qs=3JMERSakeboS%2FFOxJUMWeg%3D%3D; Arrow Part Number: MBR0530T1G; Arrow Price/Stock: https://www.arrow.com/en/products/mbr0530t1g/on-semiconductor?utm_currency=USD&region=europe
J9 = F3311A7H121024E200: Connector; Manufacturer_Name: Amphenol Communications Solutions; Datasheet Link: https://cdn.amphenol-cs.com/media/wysiwyg/files/documentation/datasheet/flex/ffc_fpc_050mm_f331.pdf; Height: 1.12mm; Manufacturer_Part_Number: F3311A7H121024E200; Mouser Part Number: 649-311A7H121024E200; Mouser Price/Stock: https://www.mouser.co.uk/ProductDetail/Amphenol-ICC-Aorora/F3311A7H121024E200/?qs=DPoM0jnrROXxrFUCHSrvbQ%3D%3D; Arrow Part Number: F3311A7H121024E200; Arrow Price/Stock: https://www.arrow.com/en/products/f3311a7h121024e200/amphenol-fci?region=nac
L2 = CMP-01768-06743366-1: EPL2010-103MLC Power inductor, shielded, 20% tol, SMT, RoHS; Core Material: Ferrite; Inductance: 10µH; RMS Current (Irms): 495mA; DC Resistance (DCR): 1Ω; Self Resonant Frequency: 33MHz; Test Frequency: 100kHz; Saturation Current: 200mA; Width: 2.2mm; Ambient Temperature Range High: 85°C; Lifecycle Status: Production; Case/Package: 0808; Max Operating Temperature: 85°C; RoHS: Compliant; Termination: SMD/SMT; Length: 2.2mm; NexarPartId: 6743366; Height: 1.05mm; Tolerance: 20%; Max DC Current: 495mA; Shielding: Shielded; Lead Free: Contains Lead; Series Resistance: 1Ω; Min Operating Temperature: -40°C
Q5 = BSS138: as Q1 on sheet main; Datasheet Link: https://www.onsemi.com/pub/Collateral/BSS138-D.PDF; Height: 1.2mm; Manufacturer_Part_Number: BSS138; Mouser Part Number: 512-BSS138; Mouser Price/Stock: https://www.mouser.co.uk/ProductDetail/onsemi-Fairchild/BSS138?qs=HK%252BeIG1iaahCeqBvjB4arg%3D%3D; Arrow Part Number: BSS138; Arrow Price/Stock: https://www.arrow.com/en/products/bss138/on-semiconductor?utm_currency=USD&region=europe
R42 = ERJ-3BQFR47V: Resistor; Manufacturer_Name: Panasonic; Datasheet Link: http://industrial.panasonic.com/cdbs/www-data/pdf/RDN0000/AOA0000C313.pdf; Manufacturer_Part_Number: ERJ-3BQFR47V; Mouser Part Number: 667-ERJ-3BQFR47V; Mouser Price/Stock: https://www.mouser.co.uk/ProductDetail/Panasonic/ERJ-3BQFR47V?qs=vIi9VVzGal8PcLrBRduGlQ%3D%3D
R43 = RT0402FRE07100KL: Resistor; Manufacturer_Name: KEMET; Datasheet Link: https://www.yageo.com/upload/media/product/productsearch/datasheet/rchip/PYu-RT_1-to-0.01_RoHS_L_11.pdf; Height: 0.35mm; Manufacturer_Part_Number: RT0402FRE07100KL; Mouser Part Number: 603-RT0402FRE07100KL; Mouser Price/Stock: https://www.mouser.co.uk/ProductDetail/YAGEO/RT0402FRE07100KL?qs=BXCcY9r%252B08CxTvf5JB1kiw%3D%3D; Arrow Part Number: RT0402FRE07100KL; Arrow Price/Stock: https://www.arrow.com/en/products/rt0402fre07100kl/yageo
R44 = ERJ-3RQF3R0V: Resistor; Manufacturer_Name: Panasonic; Datasheet Link: http://industrial.panasonic.com/cdbs/www-data/pdf/RDN0000/AOA0000C313.pdf; Manufacturer_Part_Number: ERJ-3RQF3R0V; Mouser Part Number: 667-ERJ-3RQF3R0V; Mouser Price/Stock: https://www.mouser.co.uk/ProductDetail/Panasonic/ERJ-3RQF3R0V?qs=KH2o3k57USiq02y4kowEUQ%3D%3D

## Sheet MCU.SchDoc
size A4; SheetNumber: 7; SheetTotal: 13
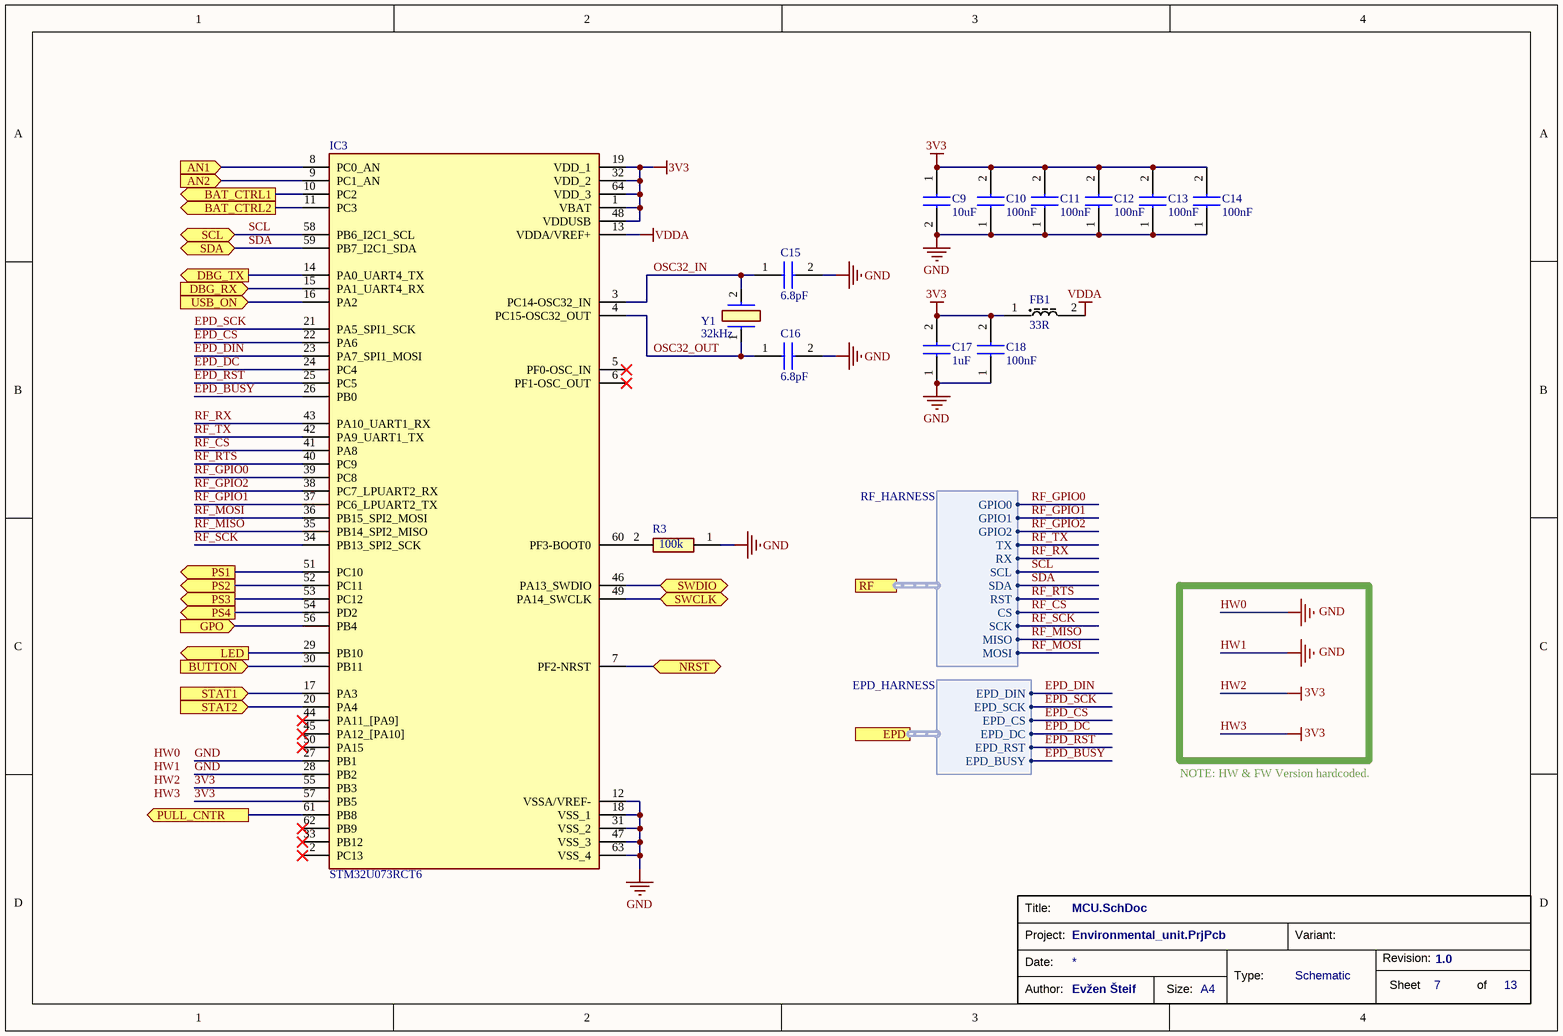
[diagram p4: MCU.SchDoc]

### Parts
C9  10uF  [GRM18x]
C10  100nF  [CAPC1005X70N]
C11  100nF  [CAPC1005X70N]
C12  100nF  [CAPC1005X70N]
C13  100nF  [CAPC1005X70N]
C14  100nF  [CAPC1005X70N]
C15  6.8pF  [GCM155]
C16  6.8pF  [GCM155]
C17  1uF  [CAPC1608X90N]
C18  100nF  [CAPC1005X70N]
FB1  33R  [BLM18SP221SN1B]
IC3  STM32U073RCT6  [QFP50P1200X1200X160-64N]
R3  100k  [RESC1005X35N]
Y1  32kHz  [ECS32712534RRTR]

### Ports
AN1 (in, see main[2B]), AN2 (in, see main[2B]), BAT_CTRL1 (out, see main[2B]), BAT_CTRL2 (out, see main[2B]), BUTTON (in, see main[2C]), DBG_RX (in, see main[3C]), DBG_TX (out, see main[3C]), EPD (harness EPD_HARNESS, see main[3C], EInkHeader[4B]), GPO (in, see main[3B], NFC[2C]), LED (out, see main[2C]), NRST (bidir, see main[2C]), PS1 (out, see main[2B], Power[3C]), PS2 (out, see main[2B], Power[3C]), PS3 (out, see main[2B], Power[3C]), PS4 (out, see main[2B], Power[3C]), PULL_CNTR (out, see main[3B]), RF (harness RF_HARNESS, see main[3C], RFHeader[2B]), SCL (bidir, see main[3B]), SDA (bidir, see main[3B]), STAT1 (in, see main[2B]), STAT2 (in, see main[2B]), SWCLK (bidir, see main[2C]), SWDIO (bidir, see main[2C]), USB_ON (in, see main[3C], USBtoUART[3C])

### Harnesses
RF_HARNESS: GPIO1, GPIO2, TX, RX, SCL, SDA, GPIO0, RST, CS, SCK, MISO, MOSI
EPD_HARNESS: EPD_DIN, EPD_SCK, EPD_CS, EPD_DC, EPD_RST, EPD_BUSY

### Nets
3V3: C9.1 C10.2 C11.2 C12.2 C13.2 C14.2 C17.2 C18.2 FB1.1 IC3.1(VBAT) IC3.19(VDD_1) IC3.32(VDD_2) IC3.48(VDDUSB) IC3.55(PB3) IC3.57(PB5) IC3.64(VDD_3)
GND: C9.2 C10.1 C11.1 C12.1 C13.1 C14.1 C15.2 C16.2 C17.1 C18.1 IC3.12(VSSA/VREF-) IC3.18(VSS_1) IC3.27(PB1) IC3.28(PB2) IC3.31(VSS_2) IC3.47(VSS_3) IC3.63(VSS_4) R3.1
VDDA: FB1.2 IC3.13(VDDA/VREF+)
BUTTON: IC3.30(PB11) ; port BUTTON
DBG_RX: IC3.15(PA1_UART4_RX) ; port DBG_RX
DBG_TX: IC3.14(PA0_UART4_TX) ; port DBG_TX
EPD_BUSY: IC3.26(PB0) ; port EPD.EPD_BUSY  [project net BUSY]
EPD_CS: IC3.22(PA6) ; port EPD.EPD_CS  [project net CS]
EPD_DC: IC3.24(PC4) ; port EPD.EPD_DC  [project net DC]
EPD_DIN: IC3.23(PA7_SPI1_MOSI) ; port EPD.EPD_DIN  [project net DIN]
EPD_RST: IC3.25(PC5) ; port EPD.EPD_RST
EPD_SCK: IC3.21(PA5_SPI1_SCK) ; port EPD.EPD_SCK
GPO: IC3.56(PB4) ; port GPO
LED: IC3.29(PB10) ; port LED
OSC32_IN: C15.1 IC3.3(PC14-OSC32_IN) Y1.2
OSC32_OUT: C16.1 IC3.4(PC15-OSC32_OUT) Y1.1
PS1: IC3.51(PC10) ; port PS1
PS2: IC3.52(PC11) ; port PS2
PS3: IC3.53(PC12) ; port PS3
PS4: IC3.54(PD2) ; port PS4
RF_CS: IC3.41(PA8) ; port RF.CS
RF_GPIO0: IC3.39(PC8) ; port RF.GPIO0
RF_GPIO1: IC3.37(PC6_LPUART2_TX) ; port RF.GPIO1
RF_GPIO2: IC3.38(PC7_LPUART2_RX) ; port RF.GPIO2
RF_MISO: IC3.35(PB14_SPI2_MISO) ; port RF.MISO
RF_MOSI: IC3.36(PB15_SPI2_MOSI) ; port RF.MOSI
RF_RTS: IC3.40(PC9) ; port RF.RST
RF_RX: IC3.43(PA10_UART1_RX) ; port RF.RX
RF_SCK: IC3.34(PB13_SPI2_SCK) ; port RF.SCK
RF_TX: IC3.42(PA9_UART1_TX) ; port RF.TX
RST: IC3.7(PF2-NRST) ; port NRST
SCL: IC3.58(PB6_I2C1_SCL) ; port SCL, port RF.SCL
SDA: IC3.59(PB7_I2C1_SDA) ; port SDA, port RF.SDA
SWDCLK: IC3.49(PA14_SWCLK) ; port SWCLK
SWDIO: IC3.46(PA13_SWDIO) ; port SWDIO
USB_ON: IC3.16(PA2) ; port USB_ON
NetIC3_8: IC3.8(PC0_AN) ; port AN1
NetIC3_9: IC3.9(PC1_AN) ; port AN2
NetIC3_10: IC3.10(PC2) ; port BAT_CTRL1
NetIC3_11: IC3.11(PC3) ; port BAT_CTRL2
NetIC3_17: IC3.17(PA3) ; port STAT1
NetIC3_20: IC3.20(PA4) ; port STAT2
NetIC3_60: IC3.60(PF3-BOOT0) R3.2
NetIC3_61: IC3.61(PB8) ; port PULL_CNTR

Not connected (* = marked no-connect by the designer): IC3 2(PC13)* 5(PF0-OSC_IN)* 6(PF1-OSC_OUT)* 33(PB12)* 44(PA11_[PA9])* 45(PA12_[PA10])* 50(PA15)* 62(PB9)*

### Notes on the sheet
- HW0
- HW1
- GND
- HW2
- 3V3
- NOTE: HW & FW Version hardcoded.
- HW3
- Title:
- Date:
- Project:
- Type:
- Schematic
- Variant:
- Revision:
- Sheet
- of
- Author:
- Evžen Šteif
- Size:
- A4

### Library data of the parts
C9 = GRM188R61E106KA73D: as C19 on sheet USBtoUART; Datasheet Link: https://search.murata.co.jp/Ceramy/image/img/A01X/G101/ENG/GRM188R61E106KA73-01A.pdf; Height: 0.9mm; Manufacturer_Part_Number: GRM188R61E106KA73D; Mouser Part Number: 81-GRM188R61E106KA3D; Mouser Price/Stock: https://www.mouser.co.uk/ProductDetail/Murata-Electronics/GRM188R61E106KA73D?qs=5aG0NVq1C4z8ebxPkQZf9A%3D%3D; Arrow Part Number: GRM188R61E106KA73D; Arrow Price/Stock: https://www.arrow.com/en/products/grm188r61e106ka73d/murata-manufacturing?region=nac
C10-C14 C18 = GRM155R61A104KA01D: as C29 on sheet main; Datasheet Link: https://search.murata.co.jp/Ceramy/image/img/A01X/G101/ENG/GRM155R61A104KA01-02A.pdf; Height: 0.7mm; Manufacturer_Part_Number: GRM155R61A104KA01D; Mouser Part Number: 81-GRM155R61A104KA01; Mouser Price/Stock: https://www.mouser.co.uk/ProductDetail/Murata-Electronics/GRM155R61A104KA01D?qs=5bAuhL3RhmNZw0v59AqOJA%3D%3D; Arrow Part Number: GRM155R61A104KA01D; Arrow Price/Stock: https://www.arrow.com/en/products/grm155r61a104ka01d/murata-manufacturing?utm_currency=USD&region=europe
C15 C16 = GCM1555C1H6R8BA16J: Capacitor; Manufacturer_Name: Murata Electronics; Datasheet Link: https://search.murata.co.jp/Ceramy/image/img/A01X/G101/ENG/GCM1555C1H6R8BA16-01A.pdf; Height: 0.55mm; Manufacturer_Part_Number: GCM1555C1H6R8BA16J; Mouser Part Number: 81-GCM1555C1H6R8BA6J; Mouser Price/Stock: https://www.mouser.co.uk/ProductDetail/Murata-Electronics/GCM1555C1H6R8BA16J?qs=QzBtWTOodeUHvskaC%252BV70A%3D%3D
C17 = GRM188R61A105KA61D: Capacitor; Manufacturer_Name: Murata Electronics; Datasheet Link: https://search.murata.co.jp/Ceramy/image/img/A01X/G101/ENG/GRM188R61A105KA61-01A.pdf; Height: 0.9mm; Manufacturer_Part_Number: GRM188R61A105KA61D; Mouser Part Number: 81-GRM39R105K10; Mouser Price/Stock: https://www.mouser.co.uk/ProductDetail/Murata-Electronics/GRM188R61A105KA61D?qs=LlFn95tWfDgsujID1PD8Jw%3D%3D; Arrow Part Number: GRM188R61A105KA61D; Arrow Price/Stock: https://www.arrow.com/en/products/grm188r61a105ka61d/murata-manufacturing?region=nac
FB1 = BLM18SG330SN1D: as FB2 on sheet USBtoUART; Datasheet Link: http://www.murata.com/~/media/webrenewal/support/library/catalog/products/emc/emifil/c31e.ashx?la=en-gb; Height: 0.95mm; Manufacturer_Part_Number: BLM18SG330SN1D; Mouser Part Number: 81-BLM18SG330SN1D; Mouser Price/Stock: https://www.mouser.co.uk/ProductDetail/Murata-Electronics/BLM18SG330SN1D?qs=7EBvPakHacUT88safgvlfQ%3D%3D; Arrow Part Number: BLM18SG330SN1D; Arrow Price/Stock: https://www.arrow.com/en/products/blm18sg330sn1d/murata-manufacturing
IC3 = STM32U073RCT6: Integrated Circuit; Manufacturer_Name: STMicroelectronics; Datasheet Link: https://www.st.com/resource/en/datasheet/stm32u073cc.pdf; Height: 1.6mm; Manufacturer_Part_Number: STM32U073RCT6
R3 = RT0402FRE07100KL: Resistor; Manufacturer_Name: KEMET; Datasheet Link: https://www.yageo.com/upload/media/product/productsearch/datasheet/rchip/PYu-RT_1-to-0.01_RoHS_L_11.pdf; Height: 0.35mm; Manufacturer_Part_Number: RT0402FRE07100KL; Mouser Part Number: 603-RT0402FRE07100KL; Mouser Price/Stock: https://www.mouser.co.uk/ProductDetail/YAGEO/RT0402FRE07100KL?qs=BXCcY9r%252B08CxTvf5JB1kiw%3D%3D; Arrow Part Number: RT0402FRE07100KL; Arrow Price/Stock: https://www.arrow.com/en/products/rt0402fre07100kl/yageo
Y1 = ECS-.327-6-34RR-TR: Crystal or Oscillator; Manufacturer_Name: ECS; Datasheet Link: https://ecsxtal.com/store/pdf/ECX-34RR.pdf; Height: 0mm; Manufacturer_Part_Number: ECS-.327-6-34RR-TR; Mouser Part Number: 520-.327-6-34RRT; Mouser Price/Stock: https://www.mouser.co.uk/ProductDetail/ECS/ECS-.327-6-34RR-TR?qs=Mv7BduZupUhhqbPNycFzzw%3D%3D; Arrow Part Number: ECS-.327-6-34RR-TR; Arrow Price/Stock: https://www.arrow.com/en/products/ecs-.327-6-34rr-tr/ecs-international?region=nac

## Sheet RFHeader.SchDoc
size A4; SheetNumber: 8; SheetTotal: 13
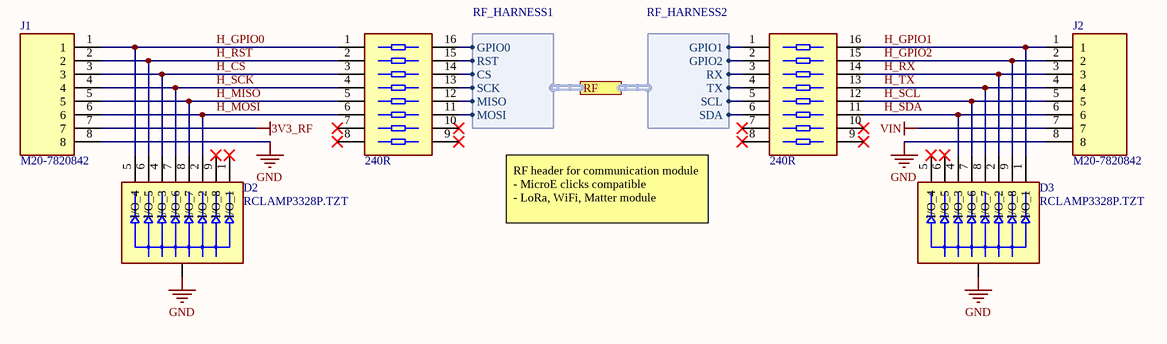
[diagram p5: RFHeader.SchDoc]

### Parts
D2  RCLAMP3328P.TZT  [RCLAMP3328PTZT]
D3  RCLAMP3328P.TZT  [RCLAMP3328PTZT]
J1  M20-7820842  [RHDR8W80P0X254_1X8_2032X254X850P]
J2  M20-7820842  [RHDR8W80P0X254_1X8_2032X254X850P]
RN1  240R  [EXBU2H]
RN2  240R  [EXBU2H]

### Ports
RF (harness RF_HARNESS1, see main[3C], MCU[3C])

### Harnesses
RF_HARNESS1: GPIO0, RST, CS, SCK, MISO, MOSI
RF_HARNESS2: GPIO1, GPIO2, TX, RX, SCL, SDA

### Nets
3V3_RF: J1.7
GND: D2.3(GND) D3.3(GND) J1.8 J2.8
VIN: J2.7
H_CS: D2.4(I/O_3) J1.3 RN1.3
H_GPIO0: D2.5(I/O_4) J1.1 RN1.1
H_GPIO1: D3.1(I/O_1) J2.1 RN2.16
H_GPIO2: D3.9(I/O_8) J2.2 RN2.15
H_MISO: D2.8(I/O_7) J1.5 RN1.5
H_MOSI: D2.2(I/O_2) J1.6 RN1.6
H_RST: D2.6(I/O_5) J1.2 RN1.2
H_RX: D3.2(I/O_2) J2.3 RN2.14
H_SCK: D2.7(I/O_6) J1.4 RN1.4
H_SCL: D3.7(I/O_6) J2.5 RN2.12
H_SDA: D3.4(I/O_3) J2.6 RN2.11
H_TX: D3.8(I/O_7) J2.4 RN2.13
RF_CS: RN1.14 ; port RF.CS
RF_GPIO0: RN1.16 ; port RF.GPIO0
RF_GPIO1: RN2.1 ; port RF.GPIO1
RF_GPIO2: RN2.2 ; port RF.GPIO2
RF_MISO: RN1.12 ; port RF.MISO
RF_MOSI: RN1.11 ; port RF.MOSI
RF_RTS: RN1.15 ; port RF.RST
RF_RX: RN2.3 ; port RF.RX
RF_SCK: RN1.13 ; port RF.SCK
RF_TX: RN2.4 ; port RF.TX
SCL: RN2.5 ; port RF.SCL
SDA: RN2.6 ; port RF.SDA

Not connected (* = marked no-connect by the designer): D2 1(I/O_1)* 9(I/O_8)*; D3 5(I/O_4)* 6(I/O_5)*; RN1 7* 8* 9* 10*; RN2 7* 8* 9* 10*

### Notes on the sheet
- RF header for communication module
  - MicroE clicks compatible
  - LoRa, WiFi, Matter module
- Title:
- Date:
- Project:
- Type:
- Schematic
- Variant:
- Revision:
- Sheet
- of
- Author:
- Evžen Šteif
- Size:
- A4

### Library data of the parts
D2 D3 = RCLAMP3328P.TZT: TVS Diode (Uni-directional); Manufacturer_Name: SEMTECH; Datasheet Link: https://media.digikey.com/pdf/Data%20Sheets/Semtech%20PDFs/RCLAMP3328P.pdf; Height: 0.525mm; Manufacturer_Part_Number: RCLAMP3328P.TZT; Mouser Part Number: 947-RCLAMP3328P.TZT; Mouser Price/Stock: https://www.mouser.co.uk/ProductDetail/Semtech/RCLAMP3328P.TZT?qs=rBWM4%252BvDhIeqoxUfuQEPWg%3D%3D; Arrow Part Number: RCLAMP3328P.TZT; Arrow Price/Stock: https://www.arrow.com/en/products/rclamp3328p.tzt/semtech?utm_currency=USD&region=europe
J1 J2 = M20-7820842: Connector; Manufacturer_Name: Harwin; Datasheet Link: https://cdn.harwin.com/pdfs/M20-782.pdf; Height: 8.5mm; Manufacturer_Part_Number: M20-7820842; Mouser Part Number: 855-M20-7820842; Mouser Price/Stock: https://www.mouser.co.uk/ProductDetail/Harwin/M20-7820842?qs=WS5Jv%252B%252Bx1qXOep0XOTvy2Q%3D%3D; System: Connector
RN1 RN2 = EXB-U2H102JV: Resistor Network (16-Pin); Manufacturer_Name: Panasonic; Datasheet Link: https://industrial.panasonic.com/cdbs/www-data/pdf/AOC0000/AOC0000C20.pdf; Height: 0.55mm; Manufacturer_Part_Number: EXB-U2H102JV; Mouser Part Number: 667-EXB-U2H102JV; Mouser Price/Stock: https://www.mouser.co.uk/ProductDetail/Panasonic/EXB-U2H102JV?qs=Z3CaLxJiOJIxUASPpxcvBQ%3D%3D; Arrow Part Number: EXB-U2H102JV; Arrow Price/Stock: null?region=nac

## Sheet Power.SchDoc: Power schematic
size A4; SheetNumber: 2; SheetTotal: 13
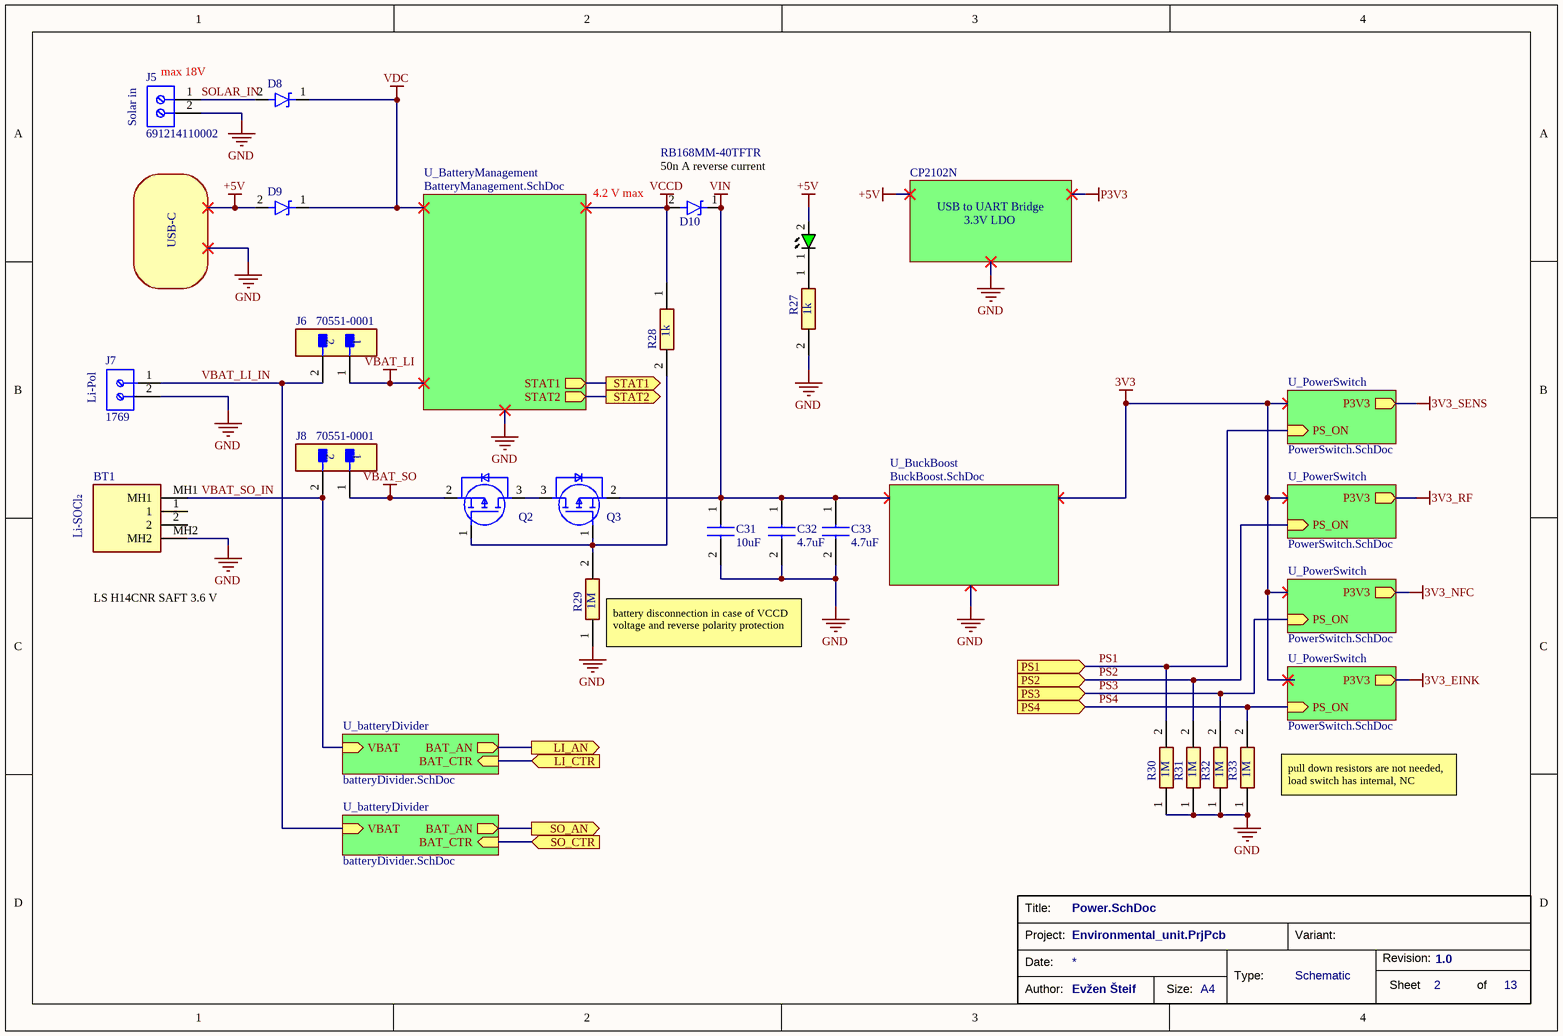
[diagram p6: Power.SchDoc]

### Parts
BT1  BX0036  [BX0036]  (value not drawn)
C31  10uF  [GRM18x]
C32  4.7uF  [CAPC1608X90N]
C33  4.7uF  [CAPC1608X90N]
D8  RB161MM-20TR  [RB161MM20TR]  (value not drawn)
D9  RB161MM-20TR  [RB161MM20TR]  (value not drawn)
D10  RB168MM-40TFTR  [RB168MM40TFTR]
J5  691214110002  [691214110002]
J6  70551-0001  [FP-70551-0036-MFG]
J7  1769  [1769]
J8  70551-0001  [FP-70551-0036-MFG]
LED6  150060GS75000  [LEDC1608X80N]  (value not drawn)
Q2  SSM3J358R,LF  [SOTFL95P240X88-3N]  (value not drawn)
Q3  SSM3J358R,LF  [SOTFL95P240X88-3N]  (value not drawn)
R27  1k  [RESC1005X35N]
R28  1k  [RESC1005X35N]
R29  1M  [RESC1005X40N]
R30  1M  [RESC1005X40N]
R31  1M  [RESC1005X40N]
R32  1M  [RESC1005X40N]
R33  1M  [RESC1005X40N]

### Sub-sheets
U_batteryDivider = batteryDivider.SchDoc (file not in this document): BAT_CTR (in), BAT_AN (out), VBAT (in)
U_batteryDivider = batteryDivider.SchDoc (file not in this document): BAT_CTR (in), BAT_AN (out), VBAT (in)
U_BatteryManagement = BatteryManagement.SchDoc: STAT1 (out), STAT2 (out)
U_BuckBoost = BuckBoost.SchDoc (file not in this document): no entries
U_PowerSwitch = PowerSwitch.SchDoc (file not in this document): PS_ON (in), P3V3 (out)
U_PowerSwitch = PowerSwitch.SchDoc (file not in this document): PS_ON (in), P3V3 (out)
U_PowerSwitch = PowerSwitch.SchDoc (file not in this document): PS_ON (in), P3V3 (out)
U_PowerSwitch = PowerSwitch.SchDoc (file not in this document): PS_ON (in), P3V3 (out)

### Ports
LI_AN (out, see main[2B]), LI_CTR (in, see main[2B]), PS1 (in, see main[2B], MCU[1C]), PS2 (in, see main[2B], MCU[1C]), PS3 (in, see main[2B], MCU[1C]), PS4 (in, see main[2B], MCU[1C]), SO_AN (out, see main[2B]), SO_CTR (in, see main[2B]), STAT1 (out, see main[2B], BatteryManagement[2B]), STAT2 (out, see main[2B], BatteryManagement[2B])

### Nets
3V3_SENS: sheet U_PowerSwitch/P3V3
+5V: D9.2(A) LED6.2(A)
GND: BT1.MH2 C31.2 C32.2 C33.2 J5.2 J7.2 R27.2 R29.1 R30.1 R31.1 R32.1 R33.1
VBAT_LI: J6.1
VBAT_SO: J8.1 Q2.2(S)
VCCD: D10.2(A) R28.1
VDC: D8.1(K) D9.1(K)
VIN: C31.1 C32.1 C33.1 D10.1(K) Q3.2(S)
PS1: R30.2 ; port PS1, sheet U_PowerSwitch/PS_ON
PS2: R31.2 ; port PS2, sheet U_PowerSwitch/PS_ON
PS3: R32.2 ; port PS3, sheet U_PowerSwitch/PS_ON
PS4: R33.2 ; port PS4, sheet U_PowerSwitch/PS_ON
SOLAR_IN: D8.2(A) J5.1
STAT1: port STAT1, sheet U_BatteryManagement/STAT1
STAT2: port STAT2, sheet U_BatteryManagement/STAT2
VBAT_LI_IN: J6.2 J7.1 ; sheet U_batteryDivider/VBAT
VBAT_SO_IN: BT1.MH1 J8.2 ; sheet U_batteryDivider/VBAT
NetIC3_8: port SO_AN, sheet U_batteryDivider/BAT_AN
NetIC3_9: port LI_AN, sheet U_batteryDivider/BAT_AN
NetIC3_10: port SO_CTR, sheet U_batteryDivider/BAT_CTR
NetIC3_11: port LI_CTR, sheet U_batteryDivider/BAT_CTR
NetLED6_1: LED6.1(K) R27.1
NetQ2_1: Q2.1(G) Q3.1(G) R28.2 R29.2
NetQ2_3: Q2.3(D) Q3.3(D)

Not connected (* = marked no-connect by the designer): BT1 1 2

### Notes on the sheet
- (near J5) max 18V
- (near J5) Solar in
- (near D10) 50n A reverse current
- CP2102N
- USB-C
- (near D10) 4.2 V max
- USB to UART Bridge
- 3.3V LDO
- (near J7) Li-Pol
- Li-SOCl₂
- (near BT1) LS H14CNR SAFT 3.6 V
- (near R29) battery disconnection in case of VCCD voltage and reverse polarity protection
- (near R33) pull down resistors are not needed, load switch has internal, NC
- Title:
- Date:
- Project:
- Type:
- Schematic
- Variant:
- Revision:
- Sheet
- of
- Author:
- Evžen Šteif
- Size:
- A4

### Library data of the parts
BT1 = BX0036: Battery; Manufacturer_Name: Bulgin; Datasheet Link: https://www.bulgin.com/pdf/pdf.php?sku=BX0036; Height: 25.1mm; Manufacturer_Part_Number: BX0036; Mouser Part Number: 122-BX0036; Mouser Price/Stock: https://www.mouser.co.uk/ProductDetail/Bulgin/BX0036?qs=mZhjc5a7U8wkz32kfV3vfA%3D%3D; Arrow Part Number: BX0036; Arrow Price/Stock: https://www.arrow.com/en/products/bx0036/bulgin-components-plc
C31 = GRM188R61E106KA73D: as C19 on sheet USBtoUART; Datasheet Link: https://search.murata.co.jp/Ceramy/image/img/A01X/G101/ENG/GRM188R61E106KA73-01A.pdf; Height: 0.9mm; Manufacturer_Part_Number: GRM188R61E106KA73D; Mouser Part Number: 81-GRM188R61E106KA3D; Mouser Price/Stock: https://www.mouser.co.uk/ProductDetail/Murata-Electronics/GRM188R61E106KA73D?qs=5aG0NVq1C4z8ebxPkQZf9A%3D%3D; Arrow Part Number: GRM188R61E106KA73D; Arrow Price/Stock: https://www.arrow.com/en/products/grm188r61e106ka73d/murata-manufacturing?region=nac
C32 C33 = GRM188R61E475KE11J: as C22 on sheet USBtoUART; Datasheet Link: https://search.murata.co.jp/Ceramy/image/img/A01X/G101/ENG/GRM188R61E475KE11-01A.pdf; Height: 0.9mm; Manufacturer_Part_Number: GRM188R61E475KE11J; Mouser Part Number: 81-GRM188R61E475KE1J; Mouser Price/Stock: https://www.mouser.co.uk/ProductDetail/Murata-Electronics/GRM188R61E475KE11J?qs=hNud%2FORuBR3%2Fa9GLJFT8KA%3D%3D; Arrow Part Number: GRM188R61E475KE11J; Arrow Price/Stock: https://www.arrow.com/en/products/grm188r61e475ke11j/murata-manufacturing
D8 D9 = RB161MM-20TR: Schottky Diode; Manufacturer_Name: ROHM Semiconductor; Datasheet Link: https://fscdn.rohm.com/en/products/databook/datasheet/discrete/diode/schottky_barrier/rb161mm-20tr-e.pdf; Height: 0.9mm; Manufacturer_Part_Number: RB161MM-20TR; Mouser Part Number: 755-RB161MM-20TR; Mouser Price/Stock: https://www.mouser.co.uk/ProductDetail/ROHM-Semiconductor/RB161MM-20TR?qs=pXoXL5qUNJ0AtQ2ZS1W0NA%3D%3D
D10 = RB168MM-40TFTR: Schottky Diode; Manufacturer_Name: ROHM Semiconductor; Datasheet Link: https://www.rohm.com/products/diodes/schottky-barrier-diodes/ultra-low-ir/rb168mm-40tf-product#productDetail; Height: 0.9mm; Manufacturer_Part_Number: RB168MM-40TFTR; Mouser Part Number: 755-RB168MM-40TFTR; Mouser Price/Stock: https://www.mouser.co.uk/ProductDetail/ROHM-Semiconductor/RB168MM-40TFTR?qs=4v%252BiZTmLVHGRj2i7xya%2FtQ%3D%3D
J5 = CMP-1502-02464-2: NexarPartId: 18818288; Plating: Brass, Steel; Current: 10A; Pitch: 3.5052mm; Number of Levels: 1; Number of Contacts: 2; Wire Gauge (Min): 16AWG; Voltage: 300V; Wire Gauge (Max): 24AWG; Stripping Length: -6mm; Number of Pins: 2; Number of Rows: 1; REACH SVHC: Unknown; RoHS: Compliant; Housing Material: Nylon; Termination: Screw; Mount: Through Hole; Contact Plating: Brass, Tin; Number of Positions Per Level: 2; Color: Blue, Green; Width: 7.9mm; Voltage Rating: 300V; Length: 7.4mm; Current Rating: 10A; Wire/Cable Gauge: 24AWG; Packaging: Box; Max Operating Temperature: 105°C; Lead Pitch: 3.5mm; Height: 8.7mm; Contact Material: Brass; Min Operating Temperature: -40°C
J6 J8 = CMP-04776-000016-1: CONN HEADER R/A 2POS 2.54MM; Manufacturer: Molex; Standoff Height: 0.25mm; Number Of Contacts: 2; Voltage Rating: 250V; Conn Orientation: Right Angle; Current Rating: 3A; Conn Gender: Male; Device Class L1: Connectors; Lead Free: Yes; Pitch: 2.54mm; Automotive: No; Digikey Description: CONN HEADER R/A 2POS 2.54MM; Octopart: https://octopart.com/70551-0036-molex-773165; Category: Conn; Temperature Range Low: -40°C; Temperature: -40°C to +105°C; Mouser Description: Connector Shrouded Header 2 Position 2.54mm Solder Right Angle Thru-Hole Tube; Temperature Range High: +105°C; Device Class L3: unset; Contact Material: Gold,Nickel; Height: 7.12mm; Package: HDR2; ComponentLink2URL: https://www.molex.com/webdocs/datasheets/pdf/en-us/0705510036_PCB_HEADERS.pdf; ComponentLink2Description: Datasheet; Number Of Rows: 1; RoHS: TRUE; Device Class L2: Headers and Wire Housings; Footprint Url: https://www.molex.com/pdm_docs/sd/705510036_sd.pdf; Manufacturer Part Number: 70551-0001
J7 = 1769: Connector; Manufacturer_Name: Adafruit; Datasheet Link: https://cdn-shop.adafruit.com/datasheets/17311.pdf; Height: 5.5mm; Manufacturer_Part_Number: 1769; Mouser Part Number: 485-1769; Mouser Price/Stock: https://www.mouser.co.uk/ProductDetail/Adafruit/1769?qs=GURawfaeGuBbgoGtf2XstA%3D%3D; Arrow Part Number: 1769; Arrow Price/Stock: https://www.arrow.com/en/products/1769/adafruit-industries?utm_currency=USD&region=nac
LED6 = 150060GS75000: LED; Manufacturer_Name: Wurth Elektronik; Datasheet Link: https://componentsearchengine.com/Datasheets/2/150060GS75000.pdf; Height: 0.8mm; Manufacturer_Part_Number: 150060GS75000; Mouser Part Number: 710-150060GS75000; Mouser Price/Stock: https://www.mouser.co.uk/ProductDetail/Wurth-Elektronik/150060GS75000?qs=LlUlMxKIyB0UYkq5lDO8nA%3D%3D
Q2 Q3 = SSM3J358R,LF: as Q6 on sheet main; Datasheet Link: https://toshiba.semicon-storage.com/ap-en/product/mosfet/detail.SSM3J358R.html; Height: 0.88mm; Manufacturer_Part_Number: SSM3J358R,LF; Mouser Part Number: 757-SSM3J358RLF; Mouser Price/Stock: https://www.mouser.co.uk/ProductDetail/Toshiba/SSM3J358RLF?qs=HXFqYaX1Q2xwvCtt1GGmkw%3D%3D; Arrow Part Number: SSM3J358R,LF; Arrow Price/Stock: https://www.arrow.com/en/products/ssm3j358rlf/toshiba?region=nac
R27 R28 = RT0402FRE071KL: Resistor; Manufacturer_Name: KEMET; Datasheet Link: https://www.yageo.com/upload/media/product/productsearch/datasheet/rchip/PYu-RT_1-to-0.01_RoHS_L_11.pdf; Height: 0.35mm; Manufacturer_Part_Number: RT0402FRE071KL; Mouser Part Number: RT0402FRE071KL; Mouser Price/Stock: https://www.mouser.co.uk/ProductDetail/YAGEO/RT0402FRE07100KL?qs=BXCcY9r%252B08CxTvf5JB1kiw%3D%3D; Arrow Part Number: RT0402FRE07100KL; Arrow Price/Stock: https://www.arrow.com/en/products/rt0402fre07100kl/yageo
R29-R33 = RC0402FR-071ML: Resistor; Manufacturer_Name: YAGEO; Datasheet Link: https://componentsearchengine.com/Datasheets/2/RC0402FR-071ML.pdf; Height: 0.4mm; Manufacturer_Part_Number: RC0402FR-071ML; Mouser Part Number: 603-RC0402FR-071ML; Mouser Price/Stock: https://www.mouser.co.uk/ProductDetail/YAGEO/RC0402FR-071ML?qs=V1yeUXFNrknfoI4987wfBQ%3D%3D; Arrow Part Number: RC0402FR-071ML; Arrow Price/Stock: https://www.arrow.com/en/products/rc0402fr-071ml/yageo?region=nac